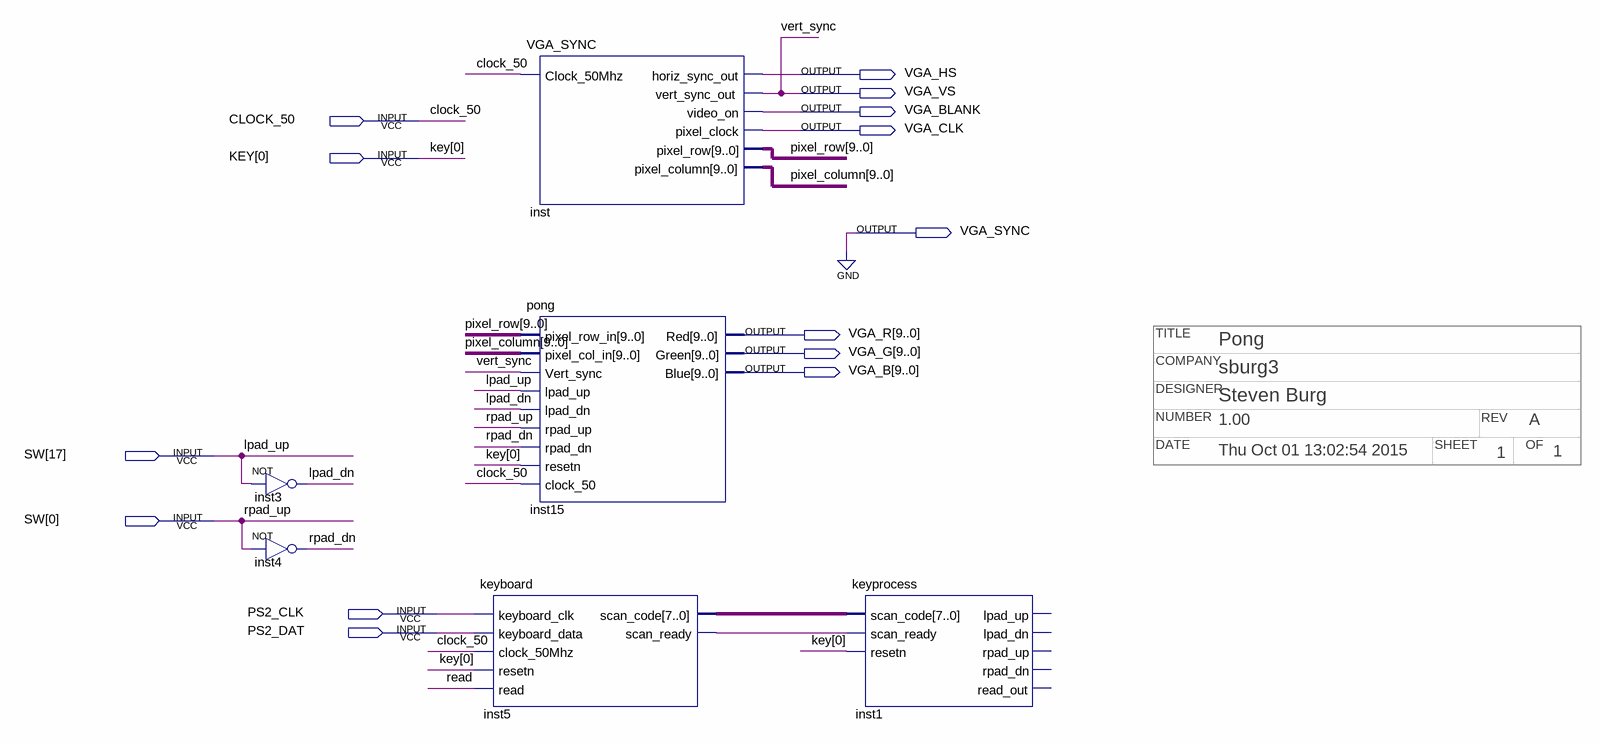
[diagram p0: schematic sheet]
// Quartus schematic pongtop.bdf as structural Verilog: 6 symbols, 14 pins
// Title block: TITLE: Pong; COMPANY: sburg3; DESIGNER: Steven Burg; NUMBER: 1.00; REV: A; DATE: Thu Oct 01 13:02:54 2015; SHEET: 1; OF: 1
module pongtop (
  input  CLOCK_50,
  input  [0:0] KEY,
  input  [17:0] SW,
  input  PS2_CLK,
  input  PS2_DAT,
  output VGA_HS,
  output VGA_VS,
  output VGA_BLANK,
  output VGA_CLK,
  output VGA_SYNC,
  output [9:0] VGA_R,
  output [9:0] VGA_G,
  output [9:0] VGA_B
);

  wire inst5_scan_ready, lpad_dn, read, rpad_dn;
  wire [7:0] inst5_scan_code;
  wire [9:0] pixel_column, pixel_row;

  not inst3 (lpad_dn, SW[17]);
  not inst4 (rpad_dn, SW[0]);
  keyboard inst5 (
    .keyboard_clk(PS2_CLK), .keyboard_data(PS2_DAT), .clock_50Mhz(CLOCK_50), .resetn(KEY[0]), .read(read),
    .scan_code(inst5_scan_code), .scan_ready(inst5_scan_ready));
  VGA_SYNC inst (
    .Clock_50Mhz(CLOCK_50), .horiz_sync_out(VGA_HS), .vert_sync_out(VGA_VS), .video_on(VGA_BLANK),
    .pixel_clock(VGA_CLK), .pixel_row(pixel_row), .pixel_column(pixel_column));
  pong inst15 (
    .pixel_row_in(pixel_row), .pixel_col_in(pixel_column), .Vert_sync(VGA_VS), .lpad_up(SW[17]),
    .lpad_dn(lpad_dn), .rpad_up(SW[0]), .rpad_dn(rpad_dn), .resetn(KEY[0]), .clock_50(CLOCK_50), .Red(VGA_R),
    .Green(VGA_G), .Blue(VGA_B));
  keyprocess inst1 (
    .scan_code(inst5_scan_code), .scan_ready(inst5_scan_ready), .resetn(KEY[0]));  // open: lpad_up, lpad_dn, rpad_up, rpad_dn, read_out

  assign VGA_SYNC = 1'b0;

  // Other names for the same wires on the sheet: rpad_up = SW[0]; lpad_up = SW[17]; vert_sync = VGA_VS
endmodule
